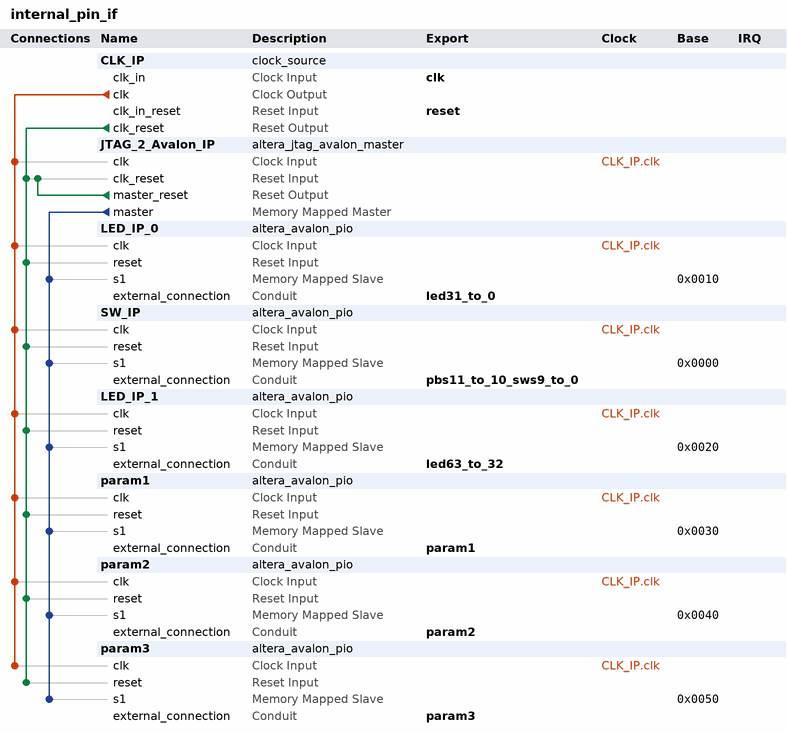
[diagram p0: system contents]
# Platform Designer (Qsys) system internal_pin_if, MAX 10 10M50DCF484C7G
# Parameters at their usual value, and those the tool derives, are not listed.
package require -exact qsys 19.1
create_system internal_pin_if
set_project_property DEVICE_FAMILY {MAX 10}
set_project_property DEVICE 10M50DCF484C7G

add_instance CLK_IP clock_source 19.1
set_instance_parameter_value CLK_IP clockFrequency 50000000

add_instance JTAG_2_Avalon_IP altera_jtag_avalon_master 19.1

add_instance LED_IP_0 altera_avalon_pio 19.1
set_instance_parameter_value LED_IP_0 direction Input
set_instance_parameter_value LED_IP_0 width 32

add_instance SW_IP altera_avalon_pio 19.1
set_instance_parameter_value SW_IP direction Output
set_instance_parameter_value SW_IP width 12

add_instance LED_IP_1 altera_avalon_pio 19.1
set_instance_parameter_value LED_IP_1 direction Input
set_instance_parameter_value LED_IP_1 width 32

add_instance param1 altera_avalon_pio 19.1
set_instance_parameter_value param1 direction Output
set_instance_parameter_value param1 width 32

add_instance param2 altera_avalon_pio 19.1
set_instance_parameter_value param2 direction Output
set_instance_parameter_value param2 width 32

add_instance param3 altera_avalon_pio 19.1
set_instance_parameter_value param3 direction Output
set_instance_parameter_value param3 width 32

# connections
add_connection CLK_IP.clk JTAG_2_Avalon_IP.clk clock
add_connection CLK_IP.clk LED_IP_0.clk clock
add_connection CLK_IP.clk LED_IP_1.clk clock
add_connection CLK_IP.clk param1.clk clock
add_connection CLK_IP.clk param2.clk clock
add_connection CLK_IP.clk param3.clk clock
add_connection CLK_IP.clk SW_IP.clk clock
add_connection CLK_IP.clk_reset JTAG_2_Avalon_IP.clk_reset reset
add_connection CLK_IP.clk_reset LED_IP_0.reset reset
add_connection CLK_IP.clk_reset LED_IP_1.reset reset
add_connection CLK_IP.clk_reset param1.reset reset
add_connection CLK_IP.clk_reset param2.reset reset
add_connection CLK_IP.clk_reset param3.reset reset
add_connection CLK_IP.clk_reset SW_IP.reset reset
add_connection JTAG_2_Avalon_IP.master_reset JTAG_2_Avalon_IP.clk_reset reset
add_connection JTAG_2_Avalon_IP.master LED_IP_0.s1 avalon
set_connection_parameter_value JTAG_2_Avalon_IP.master/LED_IP_0.s1 baseAddress 0x0010
add_connection JTAG_2_Avalon_IP.master LED_IP_1.s1 avalon
set_connection_parameter_value JTAG_2_Avalon_IP.master/LED_IP_1.s1 baseAddress 0x0020
add_connection JTAG_2_Avalon_IP.master param1.s1 avalon
set_connection_parameter_value JTAG_2_Avalon_IP.master/param1.s1 baseAddress 0x0030
add_connection JTAG_2_Avalon_IP.master param2.s1 avalon
set_connection_parameter_value JTAG_2_Avalon_IP.master/param2.s1 baseAddress 0x0040
add_connection JTAG_2_Avalon_IP.master param3.s1 avalon
set_connection_parameter_value JTAG_2_Avalon_IP.master/param3.s1 baseAddress 0x0050
add_connection JTAG_2_Avalon_IP.master SW_IP.s1 avalon
set_connection_parameter_value JTAG_2_Avalon_IP.master/SW_IP.s1 baseAddress 0x0000

# exported interfaces
add_interface clk clock sink
set_interface_property clk EXPORT_OF CLK_IP.clk_in
add_interface led31_to_0 conduit end
set_interface_property led31_to_0 EXPORT_OF LED_IP_0.external_connection
add_interface led63_to_32 conduit end
set_interface_property led63_to_32 EXPORT_OF LED_IP_1.external_connection
add_interface param1 conduit end
set_interface_property param1 EXPORT_OF param1.external_connection
add_interface param2 conduit end
set_interface_property param2 EXPORT_OF param2.external_connection
add_interface param3 conduit end
set_interface_property param3 EXPORT_OF param3.external_connection
add_interface pbs11_to_10_sws9_to_0 conduit end
set_interface_property pbs11_to_10_sws9_to_0 EXPORT_OF SW_IP.external_connection
add_interface reset reset sink
set_interface_property reset EXPORT_OF CLK_IP.clk_in_reset

set_interconnect_requirement {$system} qsys_mm.clockCrossingAdapter HANDSHAKE
set_interconnect_requirement {$system} qsys_mm.enableEccProtection FALSE
set_interconnect_requirement {$system} qsys_mm.insertDefaultSlave FALSE
set_interconnect_requirement {$system} qsys_mm.maxAdditionalLatency 1

save_system internal_pin_if.qsys
